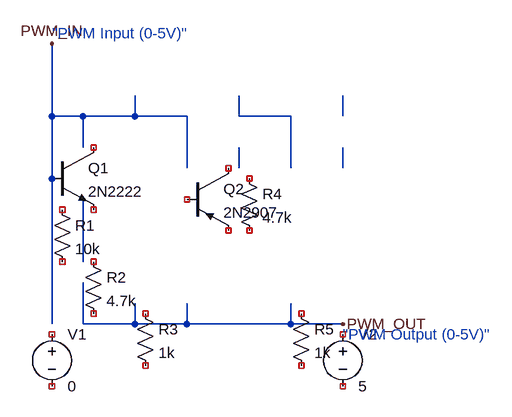
[diagram p0: schematic prueba.asc]
prueba.asc, the LTspice schematic file:
Version 4
SHEET 1 880 680
WIRE 64 64 64 32
WIRE 64 144 64 64
WIRE 64 144 112 144
WIRE 64 224 64 144
WIRE 112 192 112 144
WIRE 64 304 64 224
WIRE 112 304 112 272
WIRE 64 368 64 304
WIRE 112 368 112 304
WIRE 64 432 64 368
WIRE 112 432 112 400
WIRE 192 144 112 144
WIRE 192 144 192 112
WIRE 64 464 64 432
WIRE 112 464 112 432
WIRE 192 464 192 432
WIRE 192 464 112 464
WIRE 192 144 272 144
WIRE 272 144 272 192
WIRE 272 224 272 192
WIRE 272 464 192 464
WIRE 272 464 272 432
WIRE 272 464 352 464
WIRE 352 144 352 112
WIRE 352 224 352 192
WIRE 352 144 432 144
WIRE 432 144 432 192
WIRE 432 224 432 192
WIRE 432 464 352 464
WIRE 432 464 432 432
WIRE 432 464 512 464
WIRE 512 144 512 112
WIRE 512 224 512 192
FLAG 64 32 PWM_IN
FLAG 512 464 PWM_OUT
SYMBOL npn 64 192 R0
SYMATTR InstName Q1
SYMATTR Value 2N2222
SYMBOL pnp 272 224 R0
SYMATTR InstName Q2
SYMATTR Value 2N2907
SYMBOL res 64 272 R0
SYMATTR InstName R1
SYMATTR Value 10k
SYMBOL res 112 352 R0
SYMATTR InstName R2
SYMATTR Value 4.7k
SYMBOL res 192 432 R0
SYMATTR InstName R3
SYMATTR Value 1k
SYMBOL res 352 224 R0
SYMATTR InstName R4
SYMATTR Value 4.7k
SYMBOL res 432 432 R0
SYMATTR InstName R5
SYMATTR Value 1k
SYMBOL voltage 64 464 R0
SYMATTR InstName V1
SYMATTR Value 0
SYMBOL voltage 512 464 R0
SYMATTR InstName V2
SYMATTR Value 5
TEXT 64 16 Left "PWM Input (0-5V)"
TEXT 512 480 Left "PWM Output (0-5V)"

The netlist it stands for:
* prueba.asc
* Q1: 2N2222 (symbol npn not certain, pin order unknown); nets seen at it: 0, PWM_IN
* Q2: 2N2907 (symbol pnp not certain, pin order unknown); nets seen at it: 0
R1 NC_06 NC_07 10k
R2 NC_08 NC_09 4.7k
R3 NC_10 NC_11 1k
R4 NC_12 NC_13 4.7k
R5 NC_14 NC_15 1k
V1 NC_16 NC_17 0
V2 NC_18 NC_19 5
* "PWM Input (0-5V)"
* "PWM Output (0-5V)"
.backanno
.end